# Altium schematic sheet 15-AM64x-04.SchDoc
size B; SheetNumber: 15; SheetTotal: 25
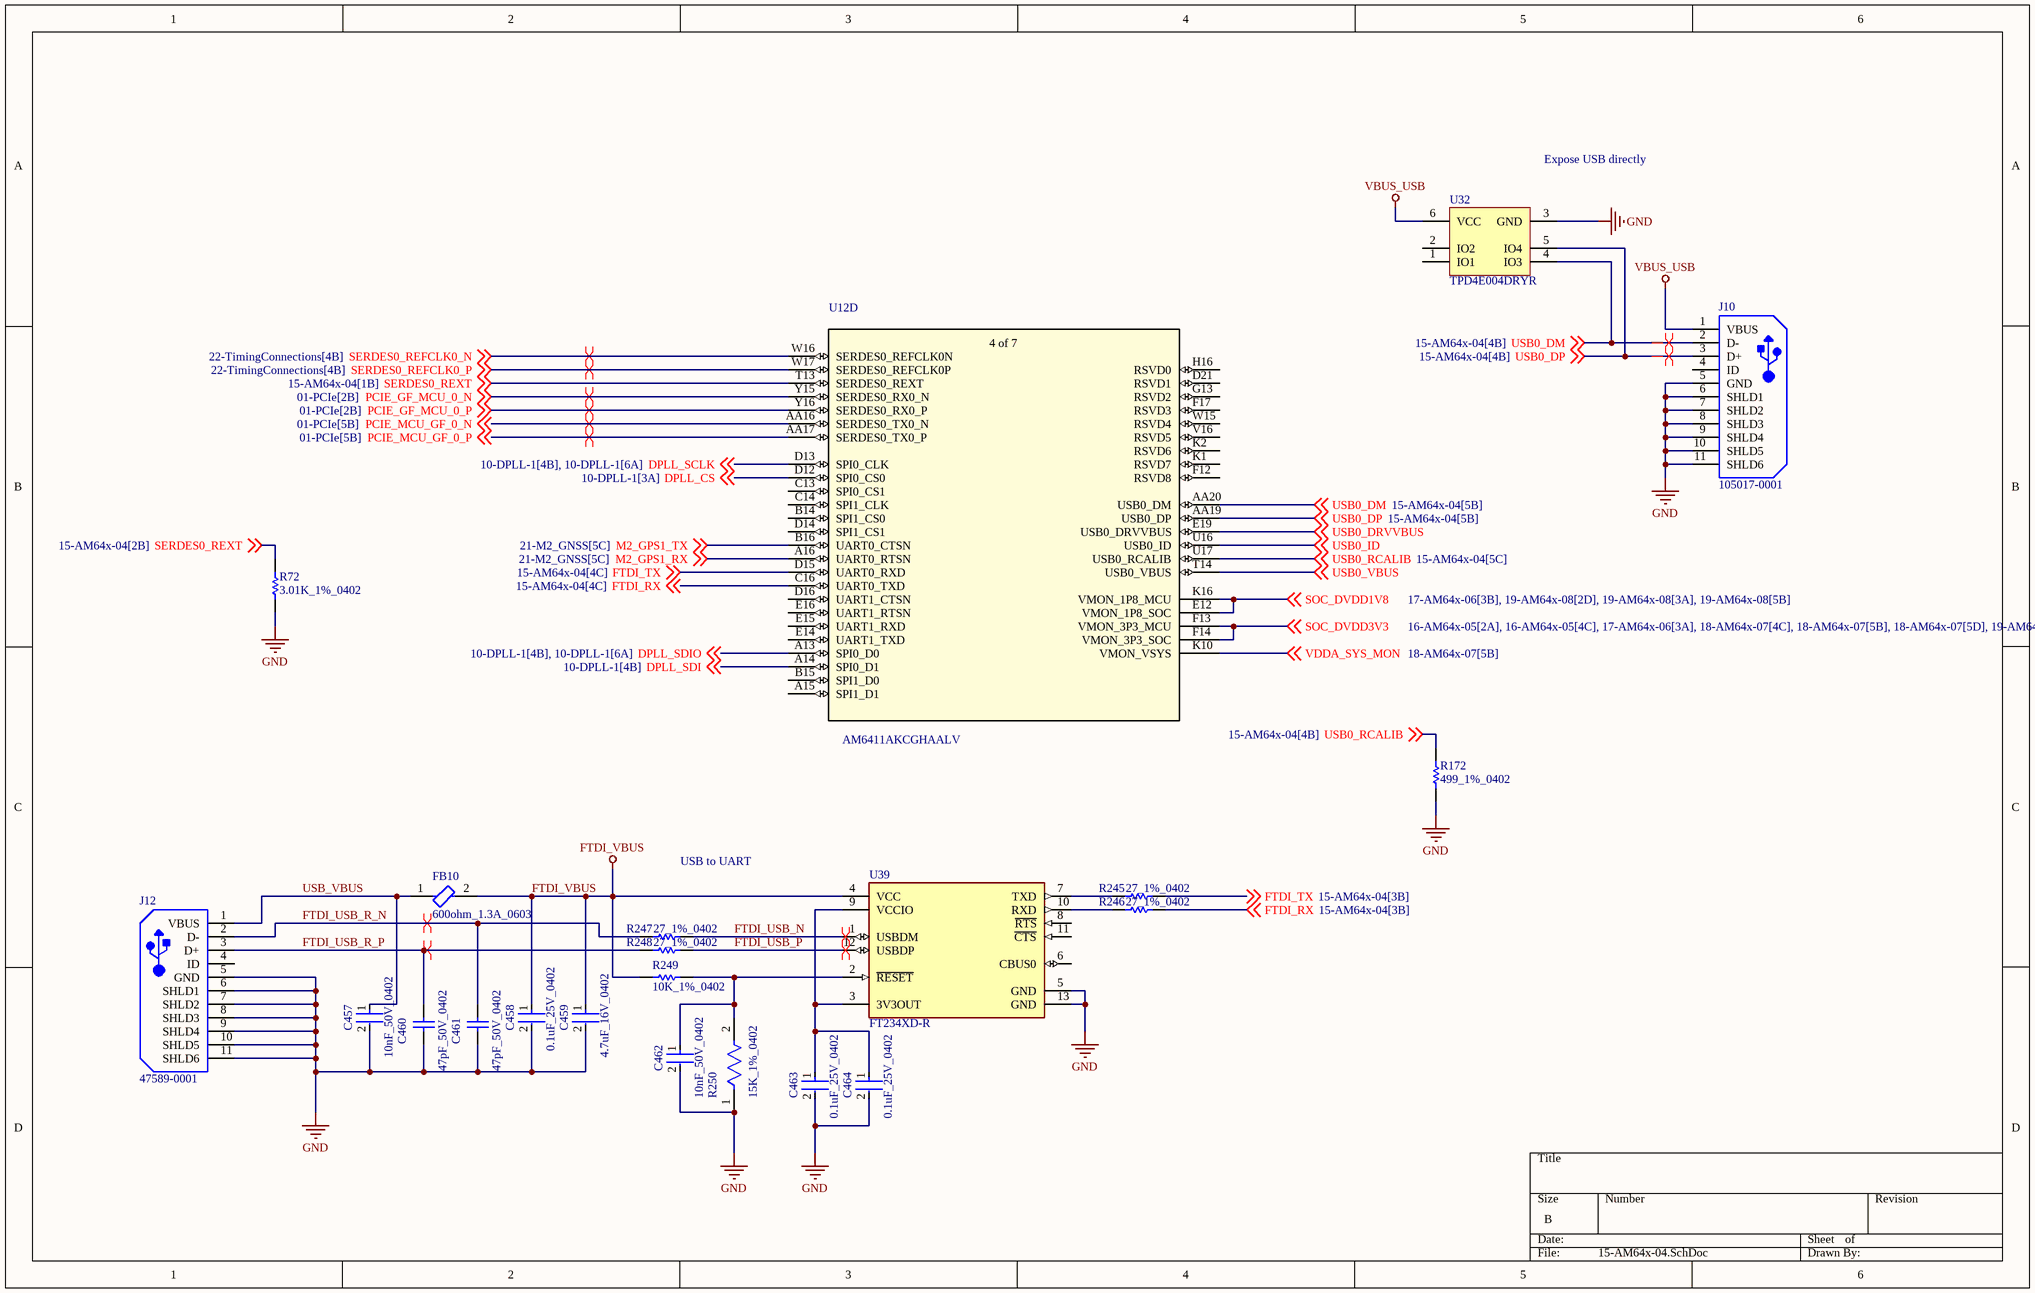
[diagram p0: 15-AM64x-04.SchDoc]

## Parts
C457  10nF_50V_0402  [FP-CC0402-MFG]
C458  0.1uF_25V_0402  [FP-0402-L_1_0_1-W_0_5_0_1-IPC_C]
C459  4.7uF_16V_0402  [FP-CL829-IPC_C]
C460  47pF_50V_0402  [CAPC1005X55X25LL05T10]
C461  47pF_50V_0402  [CAPC1005X55X25LL05T10]
C462  10nF_50V_0402  [FP-CC0402-MFG]
C463  0.1uF_25V_0402  [FP-0402-L_1_0_1-W_0_5_0_1-IPC_C]
C464  0.1uF_25V_0402  [FP-0402-L_1_0_1-W_0_5_0_1-IPC_C]
FB10  600ohm_1.3A_0603  [FP-BLM18-0_15-t0_8-IPC_A]
J10  105017-0001  [USB-MICRO-B_V]
J12  47589-0001  [MOLX-47589-0001_V]
R72  3.01K_1%_0402  [RESC1005X40X25LL05T10]
R172  499_1%_0402  [RESC1005X40X25LL05T05]
R245  27_1%_0402  [RESC1005X40X25NL05T05]
R246  27_1%_0402  [RESC1005X40X25NL05T05]
R247  27_1%_0402  [RESC1005X40X25NL05T05]
R248  27_1%_0402  [RESC1005X40X25NL05T05]
R249  10K_1%_0402  [RESC1005X40X25LL05T10]
R250  15K_1%_0402  [FP-ERJ2R-MFG]
U12  AM6411AKCGHAALV  [FCBGA441_ALV_TEX]  (part D of 7)
U32  TPD4E004DRYR  [DRY0006A]
U39  FT234XD-R  [FP-DFN-12-IPC_B]

## Nets
FTDI_VBUS: C458.1 C459.1 FB10.2 R249.2 U39.4(VCC)
GND: C457.2 C458.2 C459.2 C460.1 C461.1 C462.2 C463.2 C464.2 J10.5(GND) J10.6(SHLD1) J10.7(SHLD2) J10.8(SHLD3) J10.9(SHLD4) J10.10(SHLD5) J10.11(SHLD6) J12.5(GND) J12.6(SHLD1) J12.7(SHLD2) J12.8(SHLD3) J12.9(SHLD4) J12.10(SHLD5) J12.11(SHLD6) R72.1 R172.1 R250.1 U32.3(GND) U39.5(GND) U39.13(GND)
VBUS_USB: J10.1(VBUS) U32.6(VCC)
DPLL_CS: U12.D12(SPI0_CS0) ; off-sheet DPLL_CS
DPLL_SCLK: U12.D13(SPI0_CLK) ; off-sheet DPLL_SCLK
DPLL_SDI: U12.A14(SPI0_D1) ; off-sheet DPLL_SDI
DPLL_SDIO: U12.A13(SPI0_D0) ; off-sheet DPLL_SDIO
FTDI_RX: R246.2 U12.C16(UART0_TXD) ; off-sheet FTDI_RX
FTDI_TX: R245.2 U12.D15(UART0_RXD) ; off-sheet FTDI_TX
FTDI_USB_N: R247.2 U39.1(USBDM)
FTDI_USB_P: R248.2 U39.12(USBDP)
FTDI_USB_R_N: C461.2 J12.2(D-) R247.1
FTDI_USB_R_P: C460.2 J12.3(D+) R248.1
M2_GPS1_RX: U12.A16(UART0_RTSN) ; off-sheet M2_GPS1_RX
M2_GPS1_TX: U12.B16(UART0_CTSN) ; off-sheet M2_GPS1_TX
PCIE_GF_MCU_0_N: U12.Y15(SERDES0_RX0_N) ; off-sheet PCIE_GF_MCU_0_N
PCIE_GF_MCU_0_P: U12.Y16(SERDES0_RX0_P) ; off-sheet PCIE_GF_MCU_0_P
PCIE_MCU_GF_0_N: U12.AA16(SERDES0_TX0_N) ; off-sheet PCIE_MCU_GF_0_N
PCIE_MCU_GF_0_P: U12.AA17(SERDES0_TX0_P) ; off-sheet PCIE_MCU_GF_0_P
SERDES0_REFCLK0_N: U12.W16(SERDES0_REFCLK0N) ; off-sheet SERDES0_REFCLK0_N
SERDES0_REFCLK0_P: U12.W17(SERDES0_REFCLK0P) ; off-sheet SERDES0_REFCLK0_P
SERDES0_REXT: R72.2 U12.T13(SERDES0_REXT) ; off-sheet SERDES0_REXT
SOC_DVDD1V8: U12.E12(VMON_1P8_SOC) U12.K16(VMON_1P8_MCU) ; off-sheet SOC_DVDD1V8
SOC_DVDD3V3: U12.F13(VMON_3P3_MCU) U12.F14(VMON_3P3_SOC) ; off-sheet SOC_DVDD3V3
USB0_DM: J10.2(D-) U12.AA20(USB0_DM) U32.4(IO3) ; off-sheet USB0_DM
USB0_DP: J10.3(D+) U12.AA19(USB0_DP) U32.5(IO4) ; off-sheet USB0_DP
USB0_DRVVBUS: U12.E19(USB0_DRVVBUS) ; off-sheet USB0_DRVVBUS
USB0_ID: U12.U16(USB0_ID) ; off-sheet USB0_ID
USB0_RCALIB: R172.2 U12.U17(USB0_RCALIB) ; off-sheet USB0_RCALIB
USB0_VBUS: U12.T14(USB0_VBUS) ; off-sheet USB0_VBUS
USB_VBUS: C457.1 FB10.1 J12.1(VBUS)
VDDA_SYS_MON: U12.K10(VMON_VSYS) ; off-sheet VDDA_SYS_MON
NetC462_1: C462.1 R249.1 R250.2 U39.2(~{RESET})
NetC463_1: C463.1 C464.1 U39.3(3V3OUT) U39.9(VCCIO)
NetR245_1: R245.1 U39.7(TXD)
NetR246_1: R246.1 U39.10(RXD)

Not connected (* = marked no-connect by the designer): J10 4(ID); J12 4(ID); U12 A15(SPI1_D1) B14(SPI1_CS0) B15(SPI1_D0) C13(SPI0_CS1) C14(SPI1_CLK) D14(SPI1_CS1) D16(UART1_CTSN) D21(RSVD1) E14(UART1_TXD) E15(UART1_RXD) E16(UART1_RTSN) F12(RSVD8) F17(RSVD3) G13(RSVD2) H16(RSVD0) K1(RSVD7) K2(RSVD6) V16(RSVD5) W15(RSVD4); U32 1(IO1) 2(IO2); U39 6(CBUS0) 8(~{RTS}) 11(~{CTS})

## Layout directives
differential pair: FTDI_USB_N, FTDI_USB_P, FTDI_USB_R_N, FTDI_USB_R_P, PCIE_GF_MCU_0_N, PCIE_GF_MCU_0_P, PCIE_MCU_GF_0_N, PCIE_MCU_GF_0_P, SERDES0_REFCLK0_N, SERDES0_REFCLK0_P, USB0_DM, USB0_DP

## Notes on the sheet
- Expose USB directly
- USB to UART
- (in symbol AM6411AKCGHAALV, part D) 4 of 7

## Library data of the parts
C457 C462 = CMP-2100-03592-2: CAP CER 10000PF 50V X7R 0402; Manufacturer Part Number: CC0402KRX7R9BB103; Manufacturer: YAGEO; Temperature Coefficient: 30ppm/°C; Capacitance: 10 nF; Material: Ceramic; Automotive Grade: NA; Tolerance: 0.1; Value: 10 nF; Device Class L3: Ceramic Capacitors; Temperature: -55°C to +125°C; Footprint Url: http://www.yageo.com/exep/pages/download/literatures/UPY-C_GEN_24.pdf; Ipc Land Pattern Name: CAPC10050X50; Device Class L1: Passive Components; Automotive: No; Octopart: https://octopart.com/cc0402krx7r9bb103-yageo-8376513; Lead Free: Yes; Temperature Range Low: -55°C; Height: 0.55mm; ComponentLink2URL: http://www.yageo.com/documents/recent/UPY-GP_NP0_16V-to-50V_16.pdf; Category: Cap; ComponentLink2Description: Datasheet; Temperature Range High: +125°C; Digikey Description: CAP CER 10000PF 50V X7R 0402; Voltage Rating: 50 V; Package: CC0402; Device Class L2: Capacitors; Mouser Description: 0402 10 nF 50 V ±10 % Tolerance X7R SMT Multilayer Ceramic Capacitor; RoHS: TRUE; Temperature Characteristic: X7R
C458 C463 C464 = CMP-2008-02519-2: General Purpose Ceramic Capacitor, 0402, 100nF, 10%, X7R, 15%, 25V; Package Quantity: 1; Capacitance: 100nF; Min Operating Temperature: -55°C; Voltage: 25V; Voltage Rating: 25V; Construction: Flat; Max Operating Temperature: 125°C; Radiation Hardening: No; Depth: 0.5mm; Thickness: 0.022inch; Voltage Rating (DC): 25V; Number of Pins: 2; Lead Free: Lead Free; Series: -; REACH SVHC: No SVHC; Length: 1mm; Dielectric: X7R; RoHS Compliant: Yes; Mount: Surface Mount; Packaging: Tape and Reel; Case/Package: 0402; Case Code (Imperial): 0402; Termination: SMD/SMT; Width: 0.02inch; Case Code (Metric): 1005; Tolerance: 10%
C459 = CMP-13271-001468-1: Cap Ceramic 4.7uF 16V X5R ±20% SMD 0402 +85°C Paper T/R; Mount: Surface Mount; Case Code (Metric): 1005; Case/Package: 0402; Length: 0.039inch; Capacitance: 4.7uF; Voltage Rating: 16V; Max Operating Temperature: 85°C; Tolerance: 20%; Thickness: 0.022inch; Min Operating Temperature: -55°C; Case Code (Imperial): 0402; Packaging: Tape and Reel; Width: 0.02inch
C460 C461 = CMP-2008-04368-1: Part Number: GRM1555C1H470JA01D; Manufacturer: Murata
FB10 = CMP-0686-00581-3: Chip Ferrite Bead, 0603, 600Ω @ 100MHz, 0.15Ω, 25%, 1.3A; Material: Steel; Number of Lines: 1; Impedance: 600R; DC Resistance (DCR): 150mR; Tolerance: 25%; Case Code (Metric): 1608; Width: 0.8mm; DC Current: 1.3A; Max DC Current: 1.3A; Package Quantity: 1; Number of Pins: 2; Military Standard: Not; RoHS Compliant: Yes; Termination: SMD/SMT; Max Operating Temperature: 125°C; Length: 1.6mm; Depth: 0.8mm; Case Code (Imperial): 0603; Series: BLM18K; Inductor Type: FERRITE BEAD; Core Material: Ferrite; Number of Circuits: 1; Height: 0.8mm; Case/Package: 0603; REACH SVHC: No SVHC; Packaging: Tape and Reel; Min Operating Temperature: -55°C; Max Current Rating: 1.3A; Radiation Hardening: No; Current Rating: 1.3A; Lead Free: Lead Free; Test Frequency: 100MHz; Weight: 7.1E-05oz
J10 = CMP-2000-05827-1: Micro-USB B Receptacle, Right Angle, Bottom Mount, Surface Mount, with Solder Tabs, -30 to 85 degC, 5-Pin USB, RoHS, Tape and Reel; Manufacturer: Molex; Featured Product: Micro-USBConnectorsUSBConnectors; Other Names: WM1399DKR; Package Version: Rev. F, 12/2012; Number of Contacts: 5; Connector Type: USB-microB; Catalog Drawings: 1050170001; 3D Model: 105017-0001.stp; Mating Products: WM17145-ND-CABLEMICROUSBBTOSTDA1.0MWM17147-ND-CABLEMICROUSBBTOSTDA2.0MWM17146-ND-CABLEMICROUSBBTOSTDA1.5M; PCN Assembly/Origin: ResinSupplier21/Oct/2015; Voltage - Max: 30V; Online Catalog: Molex-MicroUSB; Manufacturer URL: http://www.molex.com/; Package Description: 5-Leads USB, Micro B, Body 7.5 x 5 mm, Pitch 0.65 mm; Datasheet URL: http://www.molex.com/elqNow/elqRedir.htm?ref=http://www.molex.com/webdocs/datasheets/pdf/en-us/1050170001_IO_CONNECTORS.pdf; Ingress Protection: -; Datasheet Version: 03/2016; Mounting Type: BoardCutout,SurfaceMount,RightAngle; Circuits: 5; Standard Package: 1; Package Reference: MICRO-B; Package URL: http://www.molex.com/pdm_docs/sd/1050170001_sd.pdf; Category: Connectors,Interconnects; Series: -; RoHS Information: 1050170001CertofCompliance; Features: Shielded,SolderRetention; Family: USB,DVI,HDMIConnectors; Specifications: -; Gender: Receptacle; Packaging: Digi-Reel®; Mounting Technology: SurfaceMount
J12 = CMP-2000-05610-1: Right Angle Female Type AB Micro USB Connector, 30 V, 1.8 A, -30 to 85 degC, RoHS, Tape and Reel; Number of Ports: 1Port; Current Rating: 1.8A; Brand: Molex; Connector Type: MicroUSBTypeABreceptacle; Number of Contacts: 5Contact; Voltage Rating: 30VAC; Color: Black; Product: MicroUSBTypeABConnectors; Package URL: http://www.molex.com/pdm_docs/sd/475890001_sd.pdf; Contact Plating: Gold; Datasheet URL: http://www.molex.com/webdocs/datasheets/pdf/en-us/0475890001_IO_CONNECTORS.pdf; Operating Temperature Range: -20Cto+85C; Termination Style: SMD/SMT; Mounting Angle: Right; Package Reference: 47589-0001; Gender: Female; Package Description: Micro USB Connector, Pitch 0.65 mm, 5 Positions, Body 7.5 x 5.6 mm; Mounting Technology: SurfaceMount; Contact Material: CopperAlloy; Packaging: Reel; RoHS: True; Standard: USB; Manufacturer URL: http://www.molex.com/; Manufacturer: Molex; Datasheet Version: 12/2016; Product Category: USBConnectors; Series: 47589
R72 = CMP-2002-07883-1: Manufacturer: Yageo; Part Number: RC0402FR-133K01L
R172 = CMP-2002-00038-1: Manufacturer: Vishay Dale; Part Number: CRCW0402499RFKTD
R245-R248 = CMP-2002-08434-1: Part Number: CRCW040227R0FKED; Manufacturer: Vishay Dale
R249 = CMP-2002-07353-1: Part Number: RC0402FR-0710KL; Manufacturer: Yageo / Phycomp
R250 = CMP-2002-00694-4: RES SMD 15K OHM 1% 1/10W 0402; Manufacturer Part Number: ERJ-2RKF1502X; Manufacturer: Panasonic; Automotive Grade: Grade 0; Voltage Rating: 50V; Resistance: 15kΩ; Temperature Coefficient: 100ppm/°C; Power Rating: 0.1W; Value: 15kΩ; ComponentLink2URL: https://industrial.panasonic.com/cdbs/www-data/pdf/RDA0000/AOA0000C304.pdf; Automotive: Yes; Temperature: -55°C to +155°C; Height: 0.4mm; Digikey Description: RES SMD 15K OHM 1% 1/10W 0402; Category: Res; Device Class L2: Resistors; Device Class L1: Passive Components; Package: ERJ2R; Temperature Range Low: -55°C; Tolerance: 1%; Series: ERJ; Footprint Url: https://b2b-api.panasonic.eu/file_stream/pids/fileversion/1180; Mouser Description: Res Thick Film 1.0 x 0.5 mm 15K Ohm 1% 0.1W(1/10W) 100ppm/ C Molded SMD Punched Carrier T/R; Composition: Thick Film; Lead Free: Yes; Device Class L3: Chip SMD Resistors; Octopart: https://octopart.com/erj-2rkf1502x-panasonic-55404985; RoHS: TRUE; Temperature Range High: +155°C; ComponentLink2Description: Datasheet
U12 = AM6411AKCGHAALV: No Description Available; Mfr_Name: Texas Instruments; RefDes: RefDes; Type: Type
U32 = CMP-0326-00024-3: ESD-Protection Array for High-Speed Data Interfaces, 4 Channels, -40 to +85 degC, 6-pin SON (DRY), Green (RoHS & no Sb/Br); Manufacturer: Texas Instruments; USB High Speed: TRUE; IO Capacitance(Typ)(pF): 1.6; IEC 61000-4-2 Air-Gap(+/- kV): 12; SubFamily: ESD Solution; IO Leakage Current(nA): 1; Breakdown Voltage(Min)(V): 6; IEC 61000-4-2 Contact(+/- kV): 8; ComponentLink3Description: URL Link1; ComponentLink3URL: SamplesURL:http://www.ti.com/product/tpd4e004#samples; PackageReference: DRY0006A; ComponentLink2URL: http://www.ti.com/general/docs/lit/getliterature.tsp?genericPartNumber=TPD4E004&fileType=pdf; ComponentLink2Description: Datasheet; DatasheetVersion: SLVS729A; ComponentLink1Description: Manufacturer URL; PackageDescription: 6-Pin Plastic Small Outline No-Lead, 1 x 1.45 x 0.6 mm Body, 0.5 mm Pitch; 1394 / Firewire: TRUE; Serial ATA / eSATA: TRUE; Eco-Plan: Green (RoHS & no Sb/Br); ComponentLink1URL: http://www.ti.com/; PackageVersion: revF, Dec-2011; Mounting Technology: Surface Mount; PartNumber: TPD4E004DRYR
U39 = CMP-0248-00027-3: IC USB SERIAL BASIC UART 12DFN; Min Supply Voltage: 2.97V; Number of Ports: 1; Operating Supply Voltage: 5V; Operating Supply Current: 8mA; Max Supply Voltage: 5.5V; Data Rate: 3Mbps; Length: 3mm; Case/Package: DFN; Mount: Surface Mount; Packaging: Tape and Reel; Max Operating Temperature: 85°C; Height: 0.75mm; Number of Pins: 12; Number of Transceivers: 1; Package Quantity: 5000; Min Operating Temperature: -40°C; Width: 3mm; REACH SVHC: No SVHC; Interface: UART; Lead Free: Lead Free